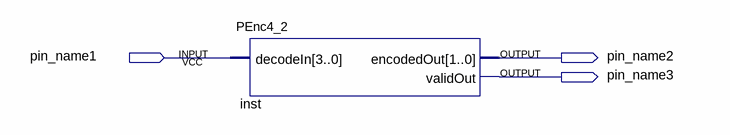
[diagram p0: schematic sheet]
// Quartus schematic PEnc4_2Demo.bdf as structural Verilog: 1 symbols, 3 pins
module PEnc4_2Demo (
  input  pin_name1,
  output pin_name2,
  output pin_name3
);

  PEnc4_2 inst (.decodeIn({4{pin_name1}}), .encodedOut(pin_name2), .validOut(pin_name3));
endmodule
